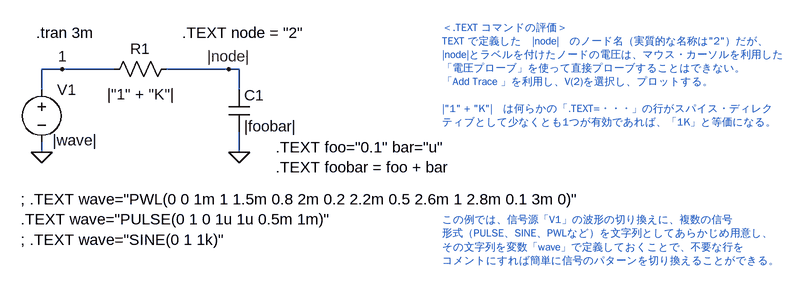
[diagram p0: schematic Fig_3-55_TEXT-command.asc]
Fig_3-55_TEXT-command.asc, the LTspice schematic file:
Version 4
SHEET 1 1376 680
WIRE 128 96 96 96
WIRE 208 96 128 96
WIRE 384 96 288 96
WIRE 400 96 384 96
WIRE 96 128 96 96
WIRE 400 128 400 96
WIRE 96 224 96 208
WIRE 400 224 400 192
FLAG 96 224 0
FLAG 400 224 0
FLAG 128 96 1
FLAG 384 96 |node|
SYMBOL voltage 96 112 R0
WINDOW 3 17 93 Left 2
WINDOW 123 0 0 Left 0
WINDOW 39 0 0 Left 0
SYMATTR Value |wave|
SYMATTR InstName V1
SYMBOL res 192 112 R270
WINDOW 0 32 56 VTop 2
WINDOW 3 -7 56 VBottom 2
SYMATTR InstName R1
SYMATTR Value |"1" + "K"|
SYMBOL cap 384 128 R0
SYMATTR InstName C1
SYMATTR Value |foobar|
TEXT 88 40 Left 2 !.tran 3m
TEXT 456 216 Left 2 !.TEXT foo="0.1" bar="u"\n.TEXT foobar = foo + bar
TEXT 712 32 Left 1 ;＜.TEXT コマンドの評価＞\nTEXT で定義した　|node|　のノード名（実質的な名称は"2"）だが、\n|node|とラベルを付けたノードの電圧は、マウス・カーソルを利用した\n「電圧プローブ」を使って直接プローブすることはできない。\n「Add Trace 」を利用し、V(2)を選択し、プロットする。\n \n|"1" + "K"|　は何らかの「.TEXT=・・・」の行がスパイス・ディレク\nティブとして少なくとも1つが有効であれば、「1K」と等価になる。
TEXT 64 296 Left 2 !; .TEXT wave="PWL(0 0 1m 1 1.5m 0.8 2m 0.2 2.2m 0.5 2.6m 1 2.8m 0.1 3m 0)"\n.TEXT wave="PULSE(0 1 0 1u 1u 0.5m 1m)"\n; .TEXT wave="SINE(0 1 1k)"
TEXT 712 328 Left 1 ;この例では、信号源「V1」の波形の切り換えに、複数の信号\n形式（PULSE、SINE、PWLなど）を文字列としてあらかじめ用意し、\nその文字列を変数「wave」で定義しておくことで、不要な行を\nコメントにすれば簡単に信号のパターンを切り換えることができる。
TEXT 312 40 Left 2 !.TEXT node = "2"

The netlist it stands for:
* Fig_3-55_TEXT-command.asc
V1 1 0 |wave|
R1 1 |node| |"1" + "K"|
C1 |node| 0 |foobar|
.tran 3m
.TEXT foo="0.1" bar="u"
.TEXT foobar = foo + bar
* ＜.TEXT コマンドの評価＞
* TEXT で定義した　|node|　のノード名（実質的な名称は"2"）だが、
* |node|とラベルを付けたノードの電圧は、マウス・カーソルを利用した
* 「電圧プローブ」を使って直接プローブすることはできない。
* 「Add Trace 」を利用し、V(2)を選択し、プロットする。
* |"1" + "K"|　は何らかの「.TEXT=・・・」の行がスパイス・ディレク
* ティブとして少なくとも1つが有効であれば、「1K」と等価になる。
; .TEXT wave="PWL(0 0 1m 1 1.5m 0.8 2m 0.2 2.2m 0.5 2.6m 1 2.8m 0.1 3m 0)"
.TEXT wave="PULSE(0 1 0 1u 1u 0.5m 1m)"
; .TEXT wave="SINE(0 1 1k)"
* この例では、信号源「V1」の波形の切り換えに、複数の信号
* 形式（PULSE、SINE、PWLなど）を文字列としてあらかじめ用意し、
* その文字列を変数「wave」で定義しておくことで、不要な行を
* コメントにすれば簡単に信号のパターンを切り換えることができる。
.TEXT node = "2"
.backanno
.end